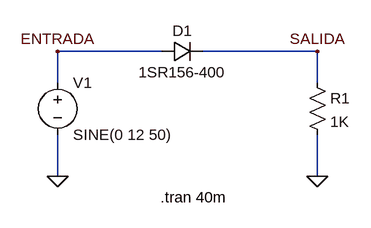
[diagram p0: schematic diodo-rectificador.asc]
diodo-rectificador.asc, the LTspice schematic file:
Version 4
SHEET 1 880 680
WIRE 160 80 0 80
WIRE 400 80 224 80
WIRE 0 128 0 80
WIRE 400 128 400 80
WIRE 0 272 0 208
WIRE 400 272 400 208
FLAG 0 272 0
FLAG 400 272 0
FLAG 400 80 SALIDA
FLAG 0 80 ENTRADA
SYMBOL diode 160 96 R270
WINDOW 0 32 32 VTop 2
WINDOW 3 0 32 VBottom 2
SYMATTR InstName D1
SYMATTR Value 1SR156-400
SYMBOL voltage 0 112 R0
WINDOW 123 0 0 Left 0
WINDOW 39 0 0 Left 0
SYMATTR InstName V1
SYMATTR Value SINE(0 12 50)
SYMBOL res 384 112 R0
SYMATTR InstName R1
SYMATTR Value 1K
TEXT 158 304 Left 2 !.tran 40m

The netlist it stands for:
* diodo-rectificador.asc
D1 ENTRADA SALIDA 1SR156-400
V1 ENTRADA 0 SINE(0 12 50)
R1 SALIDA 0 1K
.model D D
.lib standard.dio
.tran 40m
.backanno
.end